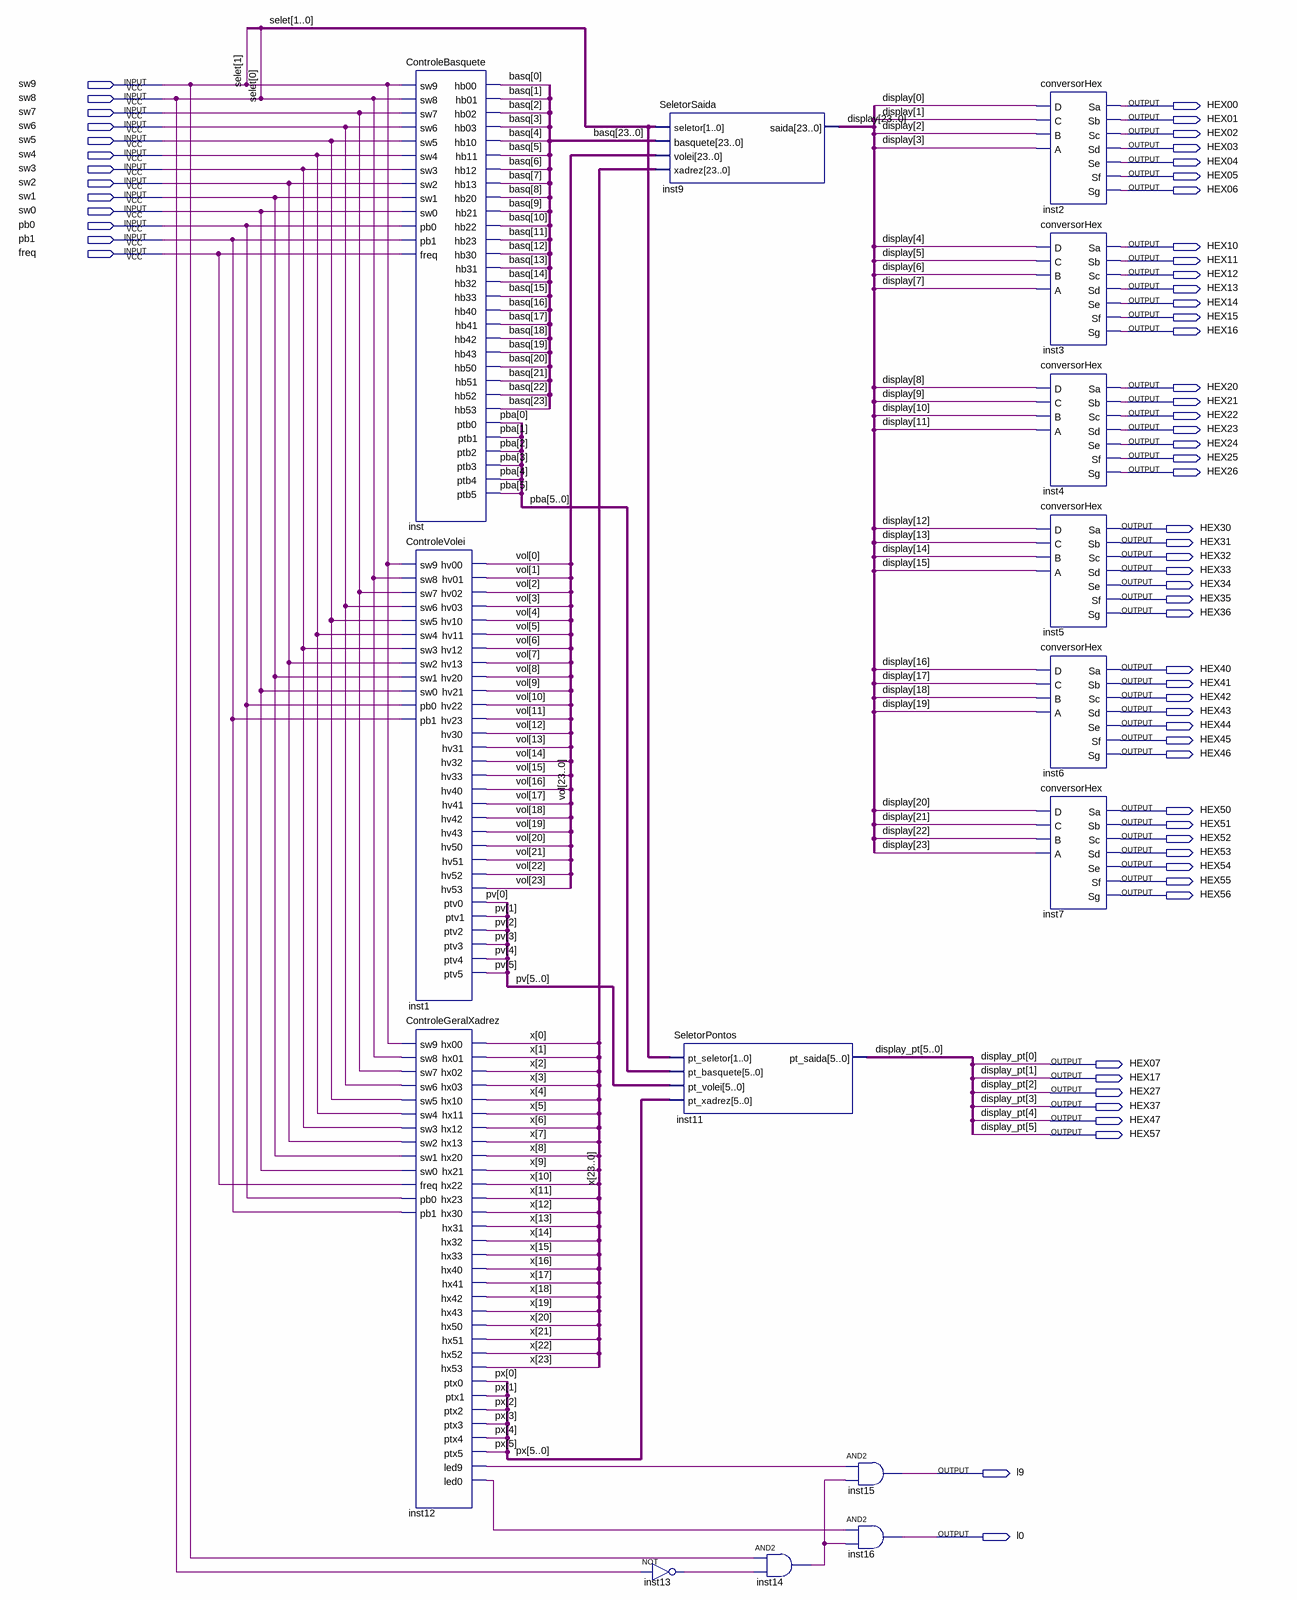
[diagram p0: schematic sheet]
// Quartus schematic PlacarELetronico.bdf as structural Verilog: 15 symbols, 63 pins
module PlacarELetronico (
  input  sw9,
  input  sw8,
  input  sw7,
  input  sw6,
  input  sw5,
  input  sw4,
  input  sw3,
  input  sw2,
  input  sw1,
  input  sw0,
  input  pb0,
  input  pb1,
  input  freq,
  output HEX00,
  output HEX01,
  output HEX02,
  output HEX03,
  output HEX04,
  output HEX05,
  output HEX06,
  output HEX10,
  output HEX11,
  output HEX12,
  output HEX13,
  output HEX14,
  output HEX15,
  output HEX16,
  output HEX20,
  output HEX21,
  output HEX22,
  output HEX23,
  output HEX24,
  output HEX25,
  output HEX26,
  output HEX30,
  output HEX31,
  output HEX32,
  output HEX33,
  output HEX34,
  output HEX35,
  output HEX36,
  output HEX40,
  output HEX41,
  output HEX42,
  output HEX43,
  output HEX44,
  output HEX45,
  output HEX46,
  output HEX50,
  output HEX51,
  output HEX52,
  output HEX53,
  output HEX54,
  output HEX55,
  output HEX56,
  output HEX07,
  output HEX17,
  output HEX27,
  output HEX37,
  output HEX47,
  output HEX57,
  output l9,
  output l0
);

  wire inst12_led0, inst12_led9, inst13_out, inst14_out;
  wire [5:0] pba, pv, px;
  wire [23:0] basq, display, vol, x;

  ControleBasquete inst (
    .sw9(sw9), .sw8(sw8), .sw7(sw7), .sw6(sw6), .sw5(sw5), .sw4(sw4), .sw3(sw3), .sw2(sw2), .sw1(sw1),
    .sw0(sw0), .pb0(pb0), .pb1(pb1), .freq(freq), .hb00(basq[0]), .hb01(basq[1]), .hb02(basq[2]),
    .hb03(basq[3]), .hb10(basq[4]), .hb11(basq[5]), .hb12(basq[6]), .hb13(basq[7]), .hb20(basq[8]),
    .hb21(basq[9]), .hb22(basq[10]), .hb23(basq[11]), .hb30(basq[12]), .hb31(basq[13]), .hb32(basq[14]),
    .hb33(basq[15]), .hb40(basq[16]), .hb41(basq[17]), .hb42(basq[18]), .hb43(basq[19]), .hb50(basq[20]),
    .hb51(basq[21]), .hb52(basq[22]), .hb53(basq[23]), .ptb0(pba[0]), .ptb1(pba[1]), .ptb2(pba[2]),
    .ptb3(pba[3]), .ptb4(pba[4]), .ptb5(pba[5]));
  ControleVolei inst1 (
    .sw9(sw9), .sw8(sw8), .sw7(sw7), .sw6(sw6), .sw5(sw5), .sw4(sw4), .sw3(sw3), .sw2(sw2), .sw1(sw1),
    .sw0(sw0), .pb0(pb0), .pb1(pb1), .hv00(vol[0]), .hv01(vol[1]), .hv02(vol[2]), .hv03(vol[3]),
    .hv10(vol[4]), .hv11(vol[5]), .hv12(vol[6]), .hv13(vol[7]), .hv20(vol[8]), .hv21(vol[9]), .hv22(vol[10]),
    .hv23(vol[11]), .hv30(vol[12]), .hv31(vol[13]), .hv32(vol[14]), .hv33(vol[15]), .hv40(vol[16]),
    .hv41(vol[17]), .hv42(vol[18]), .hv43(vol[19]), .hv50(vol[20]), .hv51(vol[21]), .hv52(vol[22]),
    .hv53(vol[23]), .ptv0(pv[0]), .ptv1(pv[1]), .ptv2(pv[2]), .ptv3(pv[3]), .ptv4(pv[4]), .ptv5(pv[5]));
  ControleGeralXadrez inst12 (
    .sw9(sw9), .sw8(sw8), .sw7(sw7), .sw6(sw6), .sw5(sw5), .sw4(sw4), .sw3(sw3), .sw2(sw2), .sw1(sw1),
    .sw0(sw0), .freq(freq), .pb0(pb0), .pb1(pb1), .hx00(x[0]), .hx01(x[1]), .hx02(x[2]), .hx03(x[3]),
    .hx10(x[4]), .hx11(x[5]), .hx12(x[6]), .hx13(x[7]), .hx20(x[8]), .hx21(x[9]), .hx22(x[10]), .hx23(x[11]),
    .hx30(x[12]), .hx31(x[13]), .hx32(x[14]), .hx33(x[15]), .hx40(x[16]), .hx41(x[17]), .hx42(x[18]),
    .hx43(x[19]), .hx50(x[20]), .hx51(x[21]), .hx52(x[22]), .hx53(x[23]), .ptx0(px[0]), .ptx1(px[1]),
    .ptx2(px[2]), .ptx3(px[3]), .ptx4(px[4]), .ptx5(px[5]), .led9(inst12_led9), .led0(inst12_led0));
  SeletorSaida inst9 (.seletor({sw9, sw8}), .basquete(basq), .volei(vol), .xadrez(x), .saida(display));
  SeletorPontos inst11 (
    .pt_seletor({sw9, sw8}), .pt_basquete(pba), .pt_volei(pv), .pt_xadrez(px),
    .pt_saida({HEX57, HEX47, HEX37, HEX27, HEX17, HEX07}));
  not inst13 (inst13_out, sw8);
  and inst14 (inst14_out, sw9, inst13_out);
  and inst15 (l9, inst12_led9, inst14_out);
  and inst16 (l0, inst12_led0, inst14_out);
  conversorHex inst2 (
    .D(display[0]), .C(display[1]), .B(display[2]), .A(display[3]), .Sa(HEX00), .Sb(HEX01), .Sc(HEX02),
    .Sd(HEX03), .Se(HEX04), .Sf(HEX05), .Sg(HEX06));
  conversorHex inst3 (
    .D(display[4]), .C(display[5]), .B(display[6]), .A(display[7]), .Sa(HEX10), .Sb(HEX11), .Sc(HEX12),
    .Sd(HEX13), .Se(HEX14), .Sf(HEX15), .Sg(HEX16));
  conversorHex inst4 (
    .D(display[8]), .C(display[9]), .B(display[10]), .A(display[11]), .Sa(HEX20), .Sb(HEX21), .Sc(HEX22),
    .Sd(HEX23), .Se(HEX24), .Sf(HEX25), .Sg(HEX26));
  conversorHex inst5 (
    .D(display[12]), .C(display[13]), .B(display[14]), .A(display[15]), .Sa(HEX30), .Sb(HEX31), .Sc(HEX32),
    .Sd(HEX33), .Se(HEX34), .Sf(HEX35), .Sg(HEX36));
  conversorHex inst6 (
    .D(display[16]), .C(display[17]), .B(display[18]), .A(display[19]), .Sa(HEX40), .Sb(HEX41), .Sc(HEX42),
    .Sd(HEX43), .Se(HEX44), .Sf(HEX45), .Sg(HEX46));
  conversorHex inst7 (
    .D(display[20]), .C(display[21]), .B(display[22]), .A(display[23]), .Sa(HEX50), .Sb(HEX51), .Sc(HEX52),
    .Sd(HEX53), .Se(HEX54), .Sf(HEX55), .Sg(HEX56));

  // Other names for the same wires on the sheet: display_pt[5:0] = {HEX57, HEX47, HEX37, HEX27, HEX17, HEX07};
  //   selet[1:0] = {sw9, sw8}
endmodule
